# Altium schematic sheet PS-DDR.SchDoc: ZoM Mod A - FPGA DDR Bank
size A4; Organization: Trenz Electronic GmbH / TT; DocumentNumber: 10; Revision: 01; SheetNumber: 10; SheetTotal: 13; Date: 12/16/2014
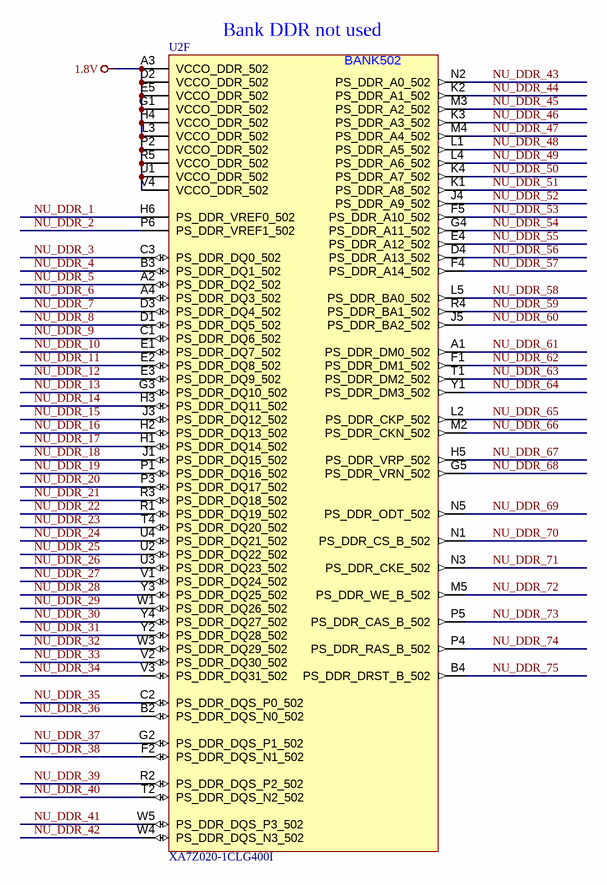
[diagram p0: PS-DDR.SchDoc]

## Parts
U2  XA7Z020-1CLG400I  [BGA400C80P20X20_1700X1700X160N]  (part F of 8)

## Nets
1.8V: U2.A3(VCCO_DDR_502) U2.D2(VCCO_DDR_502) U2.E5(VCCO_DDR_502) U2.G1(VCCO_DDR_502) U2.H4(VCCO_DDR_502) U2.L3(VCCO_DDR_502) U2.P2(VCCO_DDR_502) U2.R5(VCCO_DDR_502) U2.U1(VCCO_DDR_502) U2.V4(VCCO_DDR_502)
NU_DDR_1: U2.H6(PS_DDR_VREF0_502)
NU_DDR_2: U2.P6(PS_DDR_VREF1_502)
NU_DDR_3: U2.C3(PS_DDR_DQ0_502)
NU_DDR_4: U2.B3(PS_DDR_DQ1_502)
NU_DDR_5: U2.A2(PS_DDR_DQ2_502)
NU_DDR_6: U2.A4(PS_DDR_DQ3_502)
NU_DDR_7: U2.D3(PS_DDR_DQ4_502)
NU_DDR_8: U2.D1(PS_DDR_DQ5_502)
NU_DDR_9: U2.C1(PS_DDR_DQ6_502)
NU_DDR_10: U2.E1(PS_DDR_DQ7_502)
NU_DDR_11: U2.E2(PS_DDR_DQ8_502)
NU_DDR_12: U2.E3(PS_DDR_DQ9_502)
NU_DDR_13: U2.G3(PS_DDR_DQ10_502)
NU_DDR_14: U2.H3(PS_DDR_DQ11_502)
NU_DDR_15: U2.J3(PS_DDR_DQ12_502)
NU_DDR_16: U2.H2(PS_DDR_DQ13_502)
NU_DDR_17: U2.H1(PS_DDR_DQ14_502)
NU_DDR_18: U2.J1(PS_DDR_DQ15_502)
NU_DDR_19: U2.P1(PS_DDR_DQ16_502)
NU_DDR_20: U2.P3(PS_DDR_DQ17_502)
NU_DDR_21: U2.R3(PS_DDR_DQ18_502)
NU_DDR_22: U2.R1(PS_DDR_DQ19_502)
NU_DDR_23: U2.T4(PS_DDR_DQ20_502)
NU_DDR_24: U2.U4(PS_DDR_DQ21_502)
NU_DDR_25: U2.U2(PS_DDR_DQ22_502)
NU_DDR_26: U2.U3(PS_DDR_DQ23_502)
NU_DDR_27: U2.V1(PS_DDR_DQ24_502)
NU_DDR_28: U2.Y3(PS_DDR_DQ25_502)
NU_DDR_29: U2.W1(PS_DDR_DQ26_502)
NU_DDR_30: U2.Y4(PS_DDR_DQ27_502)
NU_DDR_31: U2.Y2(PS_DDR_DQ28_502)
NU_DDR_32: U2.W3(PS_DDR_DQ29_502)
NU_DDR_33: U2.V2(PS_DDR_DQ30_502)
NU_DDR_34: U2.V3(PS_DDR_DQ31_502)
NU_DDR_35: U2.C2(PS_DDR_DQS_P0_502)
NU_DDR_36: U2.B2(PS_DDR_DQS_N0_502)
NU_DDR_37: U2.G2(PS_DDR_DQS_P1_502)
NU_DDR_38: U2.F2(PS_DDR_DQS_N1_502)
NU_DDR_39: U2.R2(PS_DDR_DQS_P2_502)
NU_DDR_40: U2.T2(PS_DDR_DQS_N2_502)
NU_DDR_41: U2.W5(PS_DDR_DQS_P3_502)
NU_DDR_42: U2.W4(PS_DDR_DQS_N3_502)
NU_DDR_43: U2.N2(PS_DDR_A0_502)
NU_DDR_44: U2.K2(PS_DDR_A1_502)
NU_DDR_45: U2.M3(PS_DDR_A2_502)
NU_DDR_46: U2.K3(PS_DDR_A3_502)
NU_DDR_47: U2.M4(PS_DDR_A4_502)
NU_DDR_48: U2.L1(PS_DDR_A5_502)
NU_DDR_49: U2.L4(PS_DDR_A6_502)
NU_DDR_50: U2.K4(PS_DDR_A7_502)
NU_DDR_51: U2.K1(PS_DDR_A8_502)
NU_DDR_52: U2.J4(PS_DDR_A9_502)
NU_DDR_53: U2.F5(PS_DDR_A10_502)
NU_DDR_54: U2.G4(PS_DDR_A11_502)
NU_DDR_55: U2.E4(PS_DDR_A12_502)
NU_DDR_56: U2.D4(PS_DDR_A13_502)
NU_DDR_57: U2.F4(PS_DDR_A14_502)
NU_DDR_58: U2.L5(PS_DDR_BA0_502)
NU_DDR_59: U2.R4(PS_DDR_BA1_502)
NU_DDR_60: U2.J5(PS_DDR_BA2_502)
NU_DDR_61: U2.A1(PS_DDR_DM0_502)
NU_DDR_62: U2.F1(PS_DDR_DM1_502)
NU_DDR_63: U2.T1(PS_DDR_DM2_502)
NU_DDR_64: U2.Y1(PS_DDR_DM3_502)
NU_DDR_65: U2.L2(PS_DDR_CKP_502)
NU_DDR_66: U2.M2(PS_DDR_CKN_502)
NU_DDR_67: U2.H5(PS_DDR_VRP_502)
NU_DDR_68: U2.G5(PS_DDR_VRN_502)
NU_DDR_69: U2.N5(PS_DDR_ODT_502)
NU_DDR_70: U2.N1(PS_DDR_CS_B_502)
NU_DDR_71: U2.N3(PS_DDR_CKE_502)
NU_DDR_72: U2.M5(PS_DDR_WE_B_502)
NU_DDR_73: U2.P5(PS_DDR_CAS_B_502)
NU_DDR_74: U2.P4(PS_DDR_RAS_B_502)
NU_DDR_75: U2.B4(PS_DDR_DRST_B_502)

## Notes on the sheet
- (near U2) Bank DDR not used
- Title:
- Nummer:
- Rev.
- Datum:
- A4
- Zeichner:
- Blatt
- von
- Filename:
- (in symbol 25981, part F) BANK502

## Library data of the parts
U2 = 25981: AN: 25981; Mixed: SMT; Trenz-Stock: Yes; Case: CLG400; HelpURL: B:\AD\adlib\datasheet\XC7